# Altium schematic sheet Boost.SchDoc
size A4; SheetNumber: 3; SheetTotal: 3
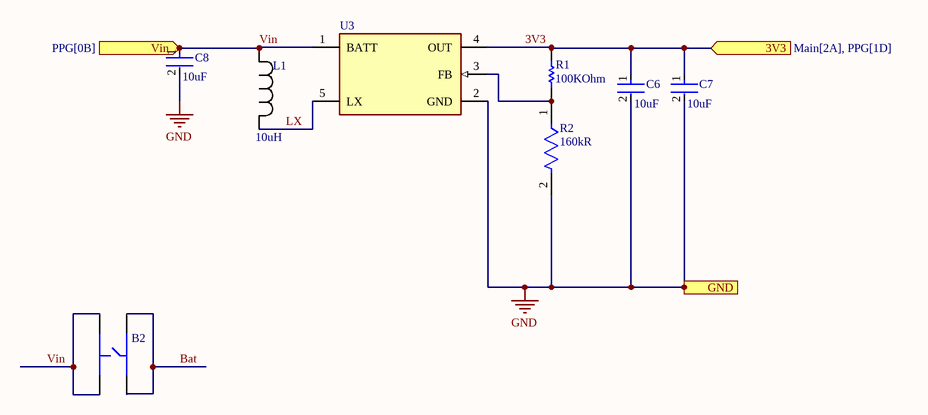
[diagram p0: Boost.SchDoc]

## Parts
B2  TS3425PA  [TS3425PA]  (value not drawn)
C6  Capacitance: 10uF  [FP-CL10-IPC_A]  (hidden comment: CL10A106MA8NRNC)
C7  Capacitance: 10uF  [FP-CL10-IPC_A]  (hidden comment: CL10A106MA8NRNC)
C8  Capacitance: 10uF  [FP-CL10-IPC_A]  (hidden comment: CL10A106MA8NRNC)
L1  value 10uH  [SWPA6028S100MT]  (hidden comment: SWPA6028S100MT)
R1  Resistance: 100KOhm  [RESC3116X65X40ML10T20]  (hidden comment: RC1206FR-07100KL)
R2  Resistance: 160kR  [FP-AC0402-IPC_B]  (hidden comment: AC0402FR-07160KL)
U3  MAX1722EZK+T  [FP-Z5-1-IPC_A]  (value not drawn)

## Ports
3V3 (in, see Main[2A], PPG[1D]), GND (in), Vin (in, see PPG[0B])

## Nets
GND: C6.2 C7.2 C8.2 R2.2 U3.2(GND) ; port GND
3V3: C6.1 C7.1 R1.2 U3.4(OUT) ; port 3V3
Bat: B2.3 B2.4
LX: L1.1 U3.5(LX)
Vin: B2.1 B2.2 C8.1 L1.2 U3.1(BATT) ; port Vin
NetR1_1: R1.1 R2.1 U3.3(FB)

## Library data of the parts
C6-C8 = CMP-13271-004224-1: Cap Ceramic 10uF 25V X5R ±20% Pad SMD 0603 +85°C T/R; Width: 0.031inch; Voltage Rating: 25V; Length: 0.063inch; Case Code (Metric): 1608; Dielectric: X5R; Termination: Wraparound; Lead Free: Lead Free; Mount: Surface Mount; Package Quantity: 1; Case Code (Imperial): 0603; Thickness: 0.035inch; Packaging: Tape and Reel; Contact Plating: Tin; Min Operating Temperature: -55°C; Tolerance: 20%; Max Operating Temperature: 85°C; Case/Package: 0603
L1 = SWPA6028S100MT: 6.0x6.0x2.8 10uH ±20% DCR=94mΩ 1.95A SRF=23MHz 应用:电源; Manufacturer: Sunlord; Supplier: Digikey; Supplier Part Number: 3442-SWPA6028S100MTCT-ND; Manufacturer Part Number: SWPA6028S100MT; RoHS: No; Stock: 912; Pricing: 1=0.69, 10=0.571, 100=0.4693, 1000=0.38596 (USD); Supplier 1: Digikey; Supplier Part Number 1: 3442-SWPA6028S100MTDKR-ND
R1 = CMP-2100-03674-1: Chip Resistor, 100 KOhm, +/- 1%, 0.25 W, -55 to 155 degC, 1206 (3216 Metric), RoHS, Tape and Reel; Manufacturer: Yageo; Voltage Rating: 200V; Temperature Coefficient: 100ppm/degreesC; Power Rating: 250mW; Case Code (Metric): 3216; Composition: ThickFilm; Lead Free: LeadFree; Max Operating Temperature: 155degC; Case/Package: 1206; Min Operating Temperature: -55degC; Depth: 1.6mm; RoHSCompliant: true; Datasheet URL: http://www.yageo.com/NewPortal/yageodocoutput?fileName=/pdf/R-Chip/PYu-RC_Group_51_RoHS_L_5.pdf; Datasheet Version: Rev. 5, 10/2016; Package Reference: 1206.0; Packaging: TapeandReel; Manufacturer URL: http://www.yageo.com/; Tolerance: 1%; Height: 0.55mm; REACH SVHC: NoSVHC; Case Code (Imperial): 1206; Length: 3.1mm; Package Description: 2-Pin Surface Mount Device, Body 3.1 x 1.6 mm; Termination: SMD/SMT
R2 = CMP-03412-020064-2: RES 160kΩ ±1% 0.063W 0402; Manufacturer: Yageo; Max Power Dissipation: 63mW; Temperature Coefficient: 100ppm/°C; Voltage Rating: 50V; Series: AC; Resistor Type: Thick Film; RoHS Compliant: Yes; Tolerance: 1%; Number of Terminations: 2; Case Code (Imperial): 0402; Case/Package: 0402; Features: Moisture Resistant; Max Operating Temperature: 155°C; Min Operating Temperature: -55°C; Length: 0.039inch; Case Code (Metric): 1005; Height: 0.015inch; Width: 0.02inch; Packaging: Tape and Reel; Supplier: Digikey; Supplier Part Number: YAG5635CT-ND; Manufacturer Part Number: AC0402FR-07160KL; RoHS: Yes; Category: Chip SMD Resistors; Stock: 26014; Pricing: 1=0.1, 10=0.009, 100=0.0071, 1000=0.0051, 2500=0.00407 (USD); ComponentLink1URL: https://datasheet.octopart.com/AC0402FR-07160KL-Yageo-datasheet-166720450.pdf?src-supplier=Future+Electronics; ComponentLink1Description: https://datasheet.octopart.com/AC0402FR-07160KL-Yageo-datasheet-166720450.pdf?src-supplier=Future+Electronics; ComponentLink2URL: https://www.yageo.com/upload/media/product/productsearch/datasheet/rchip/PYu-AC_51_RoHS_L_7.pdf?src-supplier=Digikey; ComponentLink2Description: https://www.yageo.com/upload/media/product/productsearch/datasheet/rchip/PYu-AC_51_RoHS_L_7.pdf?src-supplier=Digikey; ComponentLink3URL: http://www.yageo.com/NewPortal/yageodocoutput?fileName=/pdf/R-Chip/PYu-AC_51_RoHS_L_6.pdf&src-supplier=Digikey; ComponentLink3Description: http://www.yageo.com/NewPortal/yageodocoutput?fileName=/pdf/R-Chip/PYu-AC_51_RoHS_L_6.pdf&src-supplier=Digikey
U3 = CMP-0246-00392-2: IC REG BOOST ADJ 400MA TSOT23-5; Manufacturer: Maxim; Max Output Voltage: 5.5V; Efficiency: 90%; Max Output Current: 150mA; Number of Outputs: 1; Min Input Voltage: 800mV; Output Type: Adjustable; Min Output Voltage: 2V; Synchronous Rectifier: Yes; Mount: Surface Mount; Series: -; Packaging: Tape and Reel; Radiation Hardening: No; Package Quantity: 1; Number of Pins: 5; Operating Supply Voltage: 5.5V; Case/Package: SOT-23-5; Max Input Voltage: 5.5V; Output Current: 150mA; Min Operating Temperature: -40°C; Output Voltage: 5.5V; Lead Free: Lead Free; Topology: Boost; Max Operating Temperature: 85°C; RoHS Compliant: Yes; Supplier: Digikey; Supplier Part Number: MAX1722EZK+TCT-ND; Manufacturer Part Number: MAX1722EZK+T; RoHS: Yes; Category: Voltage Regulators - Switching; Stock: 3635; Pricing: 1=6.07, 10=4, 25=3.46, 100=2.8487, 250=2.54868, 500=2.36412, 1000=2.325 (USD); ComponentLink1URL: https://datasheet.ciiva.com/2028/max1722-max1724-2028357.pdf?src-supplier=Digikey; ComponentLink1Description: https://datasheet.ciiva.com/2028/max1722-max1724-2028357.pdf?src-supplier=Digikey; ComponentLink2URL: https://datasheet.ciiva.com/2028/max1722-max1724-2028358.pdf?src-supplier=Digikey; ComponentLink2Description: https://datasheet.ciiva.com/2028/max1722-max1724-2028358.pdf?src-supplier=Digikey; ComponentLink3URL: https://datasheet.ciiva.com/2028/max1722-max1724-2028359.pdf?src-supplier=Digikey; ComponentLink3Description: https://datasheet.ciiva.com/2028/max1722-max1724-2028359.pdf?src-supplier=Digikey